# Altium project Accelerometer_Gyroscope.PrjPcb
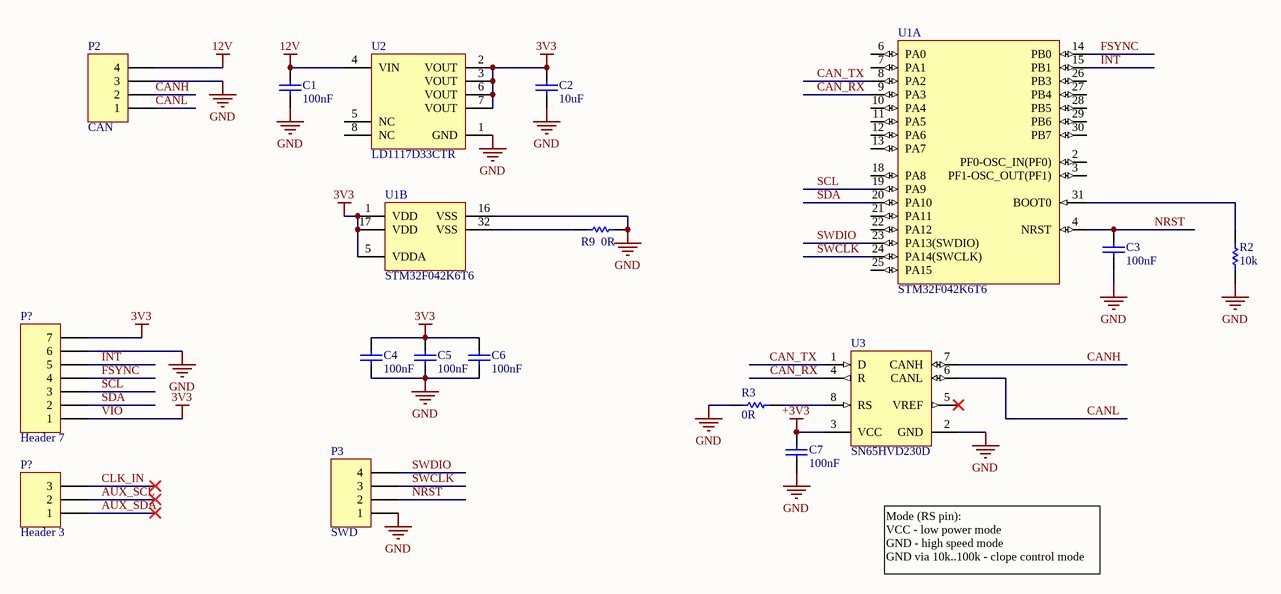
[diagram p0: Main.SchDoc]
1 sheet, 17 parts. Net scope: global (net labels, ports and power ports of the same name join across sheets).
Board file: PCB1.PcbDoc

## Sheet Main.SchDoc
size A4; Author: Wojciech Grędel; CompanyName: AGH UST; Revision: 1; ProjectName: Dashboard

### Parts
(Parts that share a designator on the sheet are numbered #1, #2 ... from top to bottom, then left to right.)
C1  value 100nF  [CAP_0805_IPC_MD]  (hidden comment: Cap)
C2  value 10uF  [CAP_0805_IPC_MD]  (hidden comment: Cap)
C3  value 100nF  [CAP_0805_IPC_MD]  (hidden comment: Cap)
C4  value 100nF  [CAP_0805_IPC_MD]  (hidden comment: Cap)
C5  value 100nF  [CAP_0805_IPC_MD]  (hidden comment: Cap)
C6  value 100nF  [CAP_0805_IPC_MD]  (hidden comment: Cap)
C7  value 100nF  [CAP_0805_IPC_MD]  (hidden comment: Cap)
P2  CAN  [HDR1X4]
P3  SWD  [HDR1X4]
P?#1  Header 7  [HDR1X7]
P?#2  Header 3  [HDR1X3]
R2  value 10k  [RES_0805_IPC_MD]  (hidden comment: Res)
R3  value 0R  [RES_0805_IPC_MD]  (hidden comment: Res)
R9  value 0R  [RES_0805_IPC_MD]  (hidden comment: Res)
U1  STM32F042K6T6  [LQFP32_IPS_MD]  (parts A,B of 2)
U2  LD1117D33CTR  [SOIC_8_IPC_MD]
U3  SN65HVD230D  [SOIC_8_IPC_MD]

### Nets
12V: C1.2 P2.4 U2.4(VIN)
+3V3: C7.2 U3.3(VCC)
GND: C1.1 C2.1 C3.1 C4.1 C5.1 C6.1 C7.1 P2.3 P3.1 P?#1.6 R2.1 R3.1 R9.2 U1.16(VSS) U2.1(GND) U3.2(GND)
VIO: C2.2 C4.2 C5.2 C6.2 P?#1.1 P?#1.7 U1.1(VDD) U1.5(VDDA) U1.17(VDD) U2.2(VOUT) U2.3(VOUT) U2.6(VOUT) U2.7(VOUT)  [also labelled 3V3]
AUX_SCL: P?#2.2
AUX_SDA: P?#2.1
CAN_RX: U1.9(PA3) U3.4(R)
CAN_TX: U1.8(PA2) U3.1(D)
CANH: P2.2 U3.7(CANH)
CANL: P2.1 U3.6(CANL)
CLK_IN: P?#2.3
FSYNC: P?#1.4 U1.14(PB0)
INT: P?#1.5 U1.15(PB1)
NRST: C3.2 P3.2 U1.4(NRST)
SCL: P?#1.3 U1.19(PA9)
SDA: P?#1.2 U1.20(PA10)
SWCLK: P3.3 U1.24(PA14(SWCLK))
SWDIO: P3.4 U1.23(PA13(SWDIO))
NetR2_2: R2.2 U1.31(BOOT0)
NetR3_2: R3.2 U3.8(RS)
NetR9_1: R9.1 U1.32(VSS)

Not connected (* = marked no-connect by the designer): U1 2(PF0-OSC_IN(PF0)) 3(PF1-OSC_OUT(PF1)) 6(PA0) 7(PA1) 10(PA4) 11(PA5) 12(PA6) 13(PA7) 18(PA8) 21(PA11) 22(PA12) 25(PA15) 26(PB3) 27(PB4) 28(PB5) 29(PB6) 30(PB7); U2 5(NC) 8(NC); U3 5(VREF)*

### Notes on the sheet
- Mode (RS pin):
  VCC - low power mode
  GND - high speed mode
  GND via 10k..100k - clope control mode
- Confidential / Not for distribution !
- Project name:
- Document name:
- Designer Name:
- Date/Time:
- Revision:

### Library data of the parts
C1-C6 = Cap: Capacitor; Supplier Part Number: *; Supplier: *; Manufacutrer: *
C7 = Cap: Capacitor; Manufacturer: Samsung; Supplier Part Number: CL21B104KBCNNNC; Supplier: TME
P2 P3 = Header 4: Header, 4-Pin; Supplier: *; Supplier Part Number: *; Manufacturer: *
P?#2 = Header 3: Header, 3-Pin; Supplier: *; Manufacturer: *; Supplier Part Number: *
R2 R3 R9 = Res: Resistor; Supplier: *; Supplier Part Number: *; Manufacturer: *
U1 = STM32F042K6T6: ARM Cortex-M0 32-bit MCU, 32 KB Flash, 6 KB Internal RAM, 26 I/Os, 32-pin LQFP, -40 to 85 degC, Tray; FLASH Size (Prog) (kB): 32; I/Os (High Current): 26; Internal RAM Size (kB): 4; Operating Frequency(F) (Processor speed) (MHz): 48; Supply Voltage(Vcc) min (V): 2.4; DatasheetVersion: Rev. 1; PackageVersion: Rev. 1, 07/2013; PackageReference: LQFP32; PackageDescription: 32-Pin Low Profile Quad Flat Package, 7 x 7 mm Body, 0.8 mm Pitch; Supplier 1: Digi-Key; Supplier Part Number 1: 497-14046-ND; Supplier 2: Newark; Supplier Part Number 2: 19X6194; Supplier 3: Mouser; Supplier Part Number 3: 511-STM32F030K6T6; Core: ARM Cortex-M0; Packing: Tray; Mounting Technology: Surface Mount; PartNumber: STM32F042K6T6; ComponentLink1Description: Manufacturer URL; ComponentLink1URL: http://www.st.com/web/en/home.html; ComponentLink2Description: Datasheet; ComponentLink2URL: http://www.st.com/st-web-ui/static/active/en/resource/technical/document/datasheet/DM00088500.pdf; ComponentLink3Description: Package Specification; ComponentLink3URL: http://www.st.com/st-web-ui/static/active/en/resource/technical/document/datasheet/DM00088500.pdf
U2 = LD1117D33CTR: Fixed Low Drop Positive Voltage Regulator, 3.3V, 8-Pin SO, Tape and Reel; DatasheetVersion: Nov-2011; PackageVersion: Dec-2002; PackageReference: SO8; PackageDescription: 8-Pin Small Outline Integrated Circuit 1.27 mm Pitch; PartNumber: LD1117D33CTR; Code_JEDEC: MS-012-AA; Code_IPC: SOIC127P600-8; ComponentLink1Description: Manufacturer URL; ComponentLink1URL: http://www.st.com; ComponentLink2Description: Datasheet; ComponentLink2URL: http://www.st.com/internet/com/TECHNICAL_RESOURCES/TECHNICAL_LITERATURE/DATASHEET/CD00000544.pdf; ComponentLink3Description: Package Specification; ComponentLink3URL: http://www.st.com/internet/com/TECHNICAL_RESOURCES/TECHNICAL_LITERATURE/PACKAGE_INFORMATION/CD00004680.pdf
U3 = SN65HVD230DR: 3.3V CAN Transceiver with Standby Mode, 17 mA, -40 to 85 degC, 8-pin SOIC (D), Green (RoHS & no Sb/Br); Manufacturer: Texas Instruments; Drivers Per Package: 1; Transient Pulse Protection(V): -25 to 25; ICC(Max)(mA): 17; Supply Voltage(s)(V): 3.3; Rating: Catalog; DatasheetVersion: SLOS346K; PackageVersion: revM, Jun-2011; PackageReference: D8; PackageDescription: 8-Pin Plastic Small Outline Integrated Circuit, 4.9 x 3.9 mm, Pitch 1.27 mm Pitch; Supplier 1: Digi-Key; Supplier Part Number 1: 296-11654-2-ND; Supplier 2: Digi-Key; Supplier Part Number 2: 296-11654-1-ND; Supplier 3: Digi-Key; Supplier Part Number 3: 296-11654-6-ND; Supplier 4: Farnell; Supplier Part Number 4: 8452148RL; Supplier 5: Farnell; Supplier Part Number 5: 8452148; Supplier 6: Newark; Supplier Part Number 6: 75C7745; Supplier 7: Mouser; Supplier Part Number 7: 595-SN65HVD230DR; Eco-Plan: Green (RoHS & no Sb/Br); SubFamily: CAN; Receivers Per Package: 1; Isolated: No; Low Power Mode: Standby; Footprint: PCA82C250; Mounting Technology: Surface Mount; PartNumber: SN65HVD230DR; Code_JEDEC: MS-012AA; ComponentLink1Description: Datasheet; ComponentLink1URL: http://www.ti.com/general/docs/lit/getliterature.tsp?genericPartNumber=SN65HVD230&fileType=pdf; Supplier Part Number: SN65HVD230D; Supplier: TME